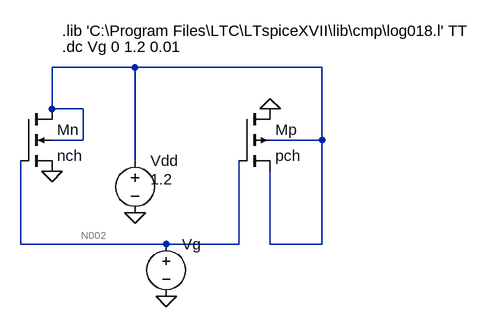
[diagram p0: schematic 5c.asc]
5c.asc, the LTspice schematic file:
Version 4
SHEET 1 880 680
WIRE -400 32 -528 32
WIRE -112 32 -400 32
WIRE -528 96 -528 32
WIRE -480 96 -528 96
WIRE -480 144 -480 96
WIRE -480 144 -528 144
WIRE -112 144 -112 32
WIRE -112 144 -192 144
WIRE -400 176 -400 32
WIRE -576 304 -576 176
WIRE -352 304 -576 304
WIRE -240 304 -240 176
WIRE -240 304 -352 304
WIRE -192 304 -192 192
WIRE -112 304 -112 144
WIRE -112 304 -192 304
FLAG -528 192 0
FLAG -352 384 0
FLAG -400 256 0
FLAG -192 96 0
SYMBOL nmos4 -576 96 R0
SYMATTR InstName Mn
SYMATTR Value nch
SYMATTR Value2 l=0.18u w=2u
SYMATTR SpiceModel nch
SYMBOL pmos4 -240 96 R0
SYMATTR InstName Mp
SYMATTR Value2 l=0.18u w=3u
SYMATTR Value pch
SYMBOL voltage -400 160 R0
WINDOW 3 24 44 Left 2
WINDOW 123 0 0 Left 0
WINDOW 39 0 0 Left 0
SYMATTR Value 1.2
SYMATTR InstName Vdd
SYMBOL voltage -352 288 R0
WINDOW 3 24 44 Left 2
WINDOW 123 0 0 Left 0
WINDOW 39 0 0 Left 0
SYMATTR Value ""
SYMATTR InstName Vg
TEXT -512 0 Left 2 !.dc Vg 0 1.2 0.01
TEXT -512 -24 Left 2 !.lib 'C:\\Program Files\\LTC\\LTspiceXVII\\lib\\cmp\\log018.l' TT

The netlist it stands for:
* 5c.asc
Mn N001 N002 0 N001 nch nch l=0.18u w=2u
Mp 0 N002 N001 N001 pch l=0.18u w=3u
Vdd N001 0 1.2
Vg N002 0
.model NMOS NMOS
.model PMOS PMOS
.lib standard.mos
.dc Vg 0 1.2 0.01
.lib 'C:\Program Files\LTC\LTspiceXVII\lib\cmp\log018.l' TT
.backanno
.end

* Results of the author's LTspice run, read from the files saved beside the schematic
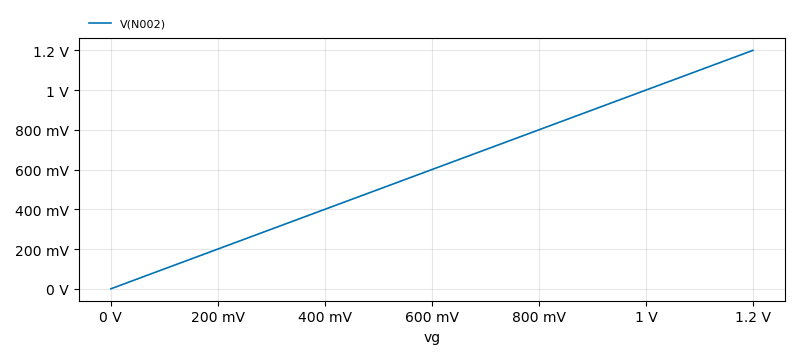
[diagram p1: DC transfer characteristic of 5c.asc, plotted from the saved traces]
* DC transfer characteristic, 1 run:
*   V(N002): 0 V at vg=0 V, 1.2 V at vg=1.2 V, min 0 V, max 1.2 V